# EAGLE design LoRaDevBreakout_FW_RevA (EAGLE 7.2.0)
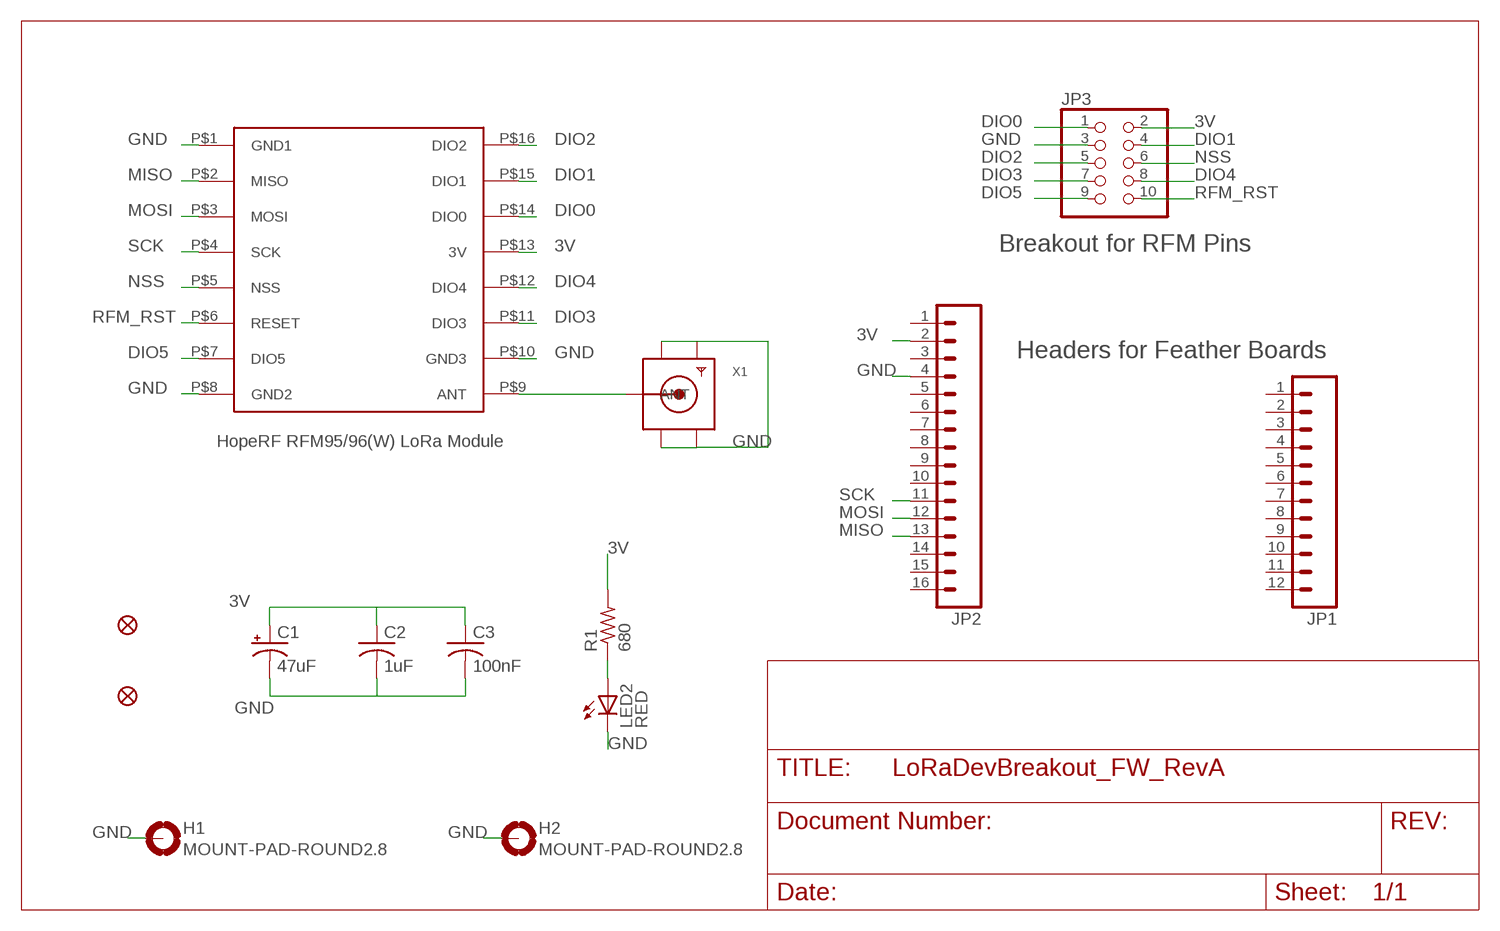
[diagram p0: schematic, sheet 1]

## Parts
C1  47uF  47UF-10V-10%(TANT)  [EIA3528]
C2  1uF  C-USC0603  [C0603]
C3  100nF  C-USC0603  [C0603]
FID1  FIDUCIAL1X2  [FIDUCIAL-1X2]
FID2  FIDUCIAL1X2  [FIDUCIAL-1X2]
H1  MOUNT-PAD-ROUND2.8  [2,8-PAD]
H2  MOUNT-PAD-ROUND2.8  [2,8-PAD]
JP1  M12NO_SILK  [1X12_NO_SILK]
JP2  M161X16_NO_SILK  [1X16_NO_SILK]
JP3  PINHD-2X5  [2X05]
LED2  RED  LEDCHIPLED_0805  [CHIPLED_0805]
R1  680  R-US_R0603  [R0603]
U$2  RFM95W  [RFM95W]
X1  SMACONNECTOR_EDGE  [SMA_EDGELAUNCH]

## Nets
3V: C1.A(+) C2.1 C3.1 JP2.2 JP3.2 R1.2 U$2.P$13(3V)
ANT: U$2.P$9(ANT) X1.P(ANT)
DIO0: JP3.1 U$2.P$14(DIO0)
DIO1: JP3.4 U$2.P$15(DIO1)
DIO2: JP3.5 U$2.P$16(DIO2)
DIO3: JP3.7 U$2.P$11(DIO3)
DIO4: JP3.8 U$2.P$12(DIO4)
DIO5: JP3.9 U$2.P$7(DIO5)
GND: C1.C(-) C2.2 C3.2 H1.B2,8(MOUNT) H2.B2,8(MOUNT) JP2.4 JP3.3 LED2.C U$2.P$1(GND1) U$2.P$8(GND2) U$2.P$10(GND3) X1.GND@1(GND4) X1.GND@2(GND3) X1.GND@3(GND2) X1.GND@4(GND1)
MISO: JP2.13 U$2.P$2(MISO)
MOSI: JP2.12 U$2.P$3(MOSI)
N$9: LED2.A R1.1
NSS: JP3.6 U$2.P$5(NSS)
RFM_RST: JP3.10 U$2.P$6(RESET)
SCK: JP2.11 U$2.P$4(SCK)
Unconnected: JP1.1 JP1.2 JP1.3 JP1.4 JP1.5 JP1.6 JP1.7 JP1.8 JP1.9 JP1.10 JP1.11 JP1.12 JP2.1 JP2.3 JP2.5 JP2.6 JP2.7 JP2.8 JP2.9 JP2.10 JP2.14 JP2.15 JP2.16

## Notes on the sheet
- Breakout for RFM Pins
- Headers for Feather Boards
- HopeRF RFM95/96(W) LoRa Module

## Library data of the parts
C1 = SparkFun-Capacitors:47UF-10V-10%(TANT): CAP-08310 47uF Tantalum SMT 10V 10% (EIA-3528); PROD_ID: CAP-08310
C2 C3 = adafruit:C-US: CAPACITOR, American symbol
FID1 FID2 = SparkFun-Aesthetics:FIDUCIAL: Fiducial Alignment Points Various fiducial points for machine vision alignment.
H1 H2 = holes:MOUNT-PAD-ROUND: MOUNTING PAD, round
JP1 = SparkFun-Connectors:M12: Header 12 Standard 12-pin 0.1" header. Use with straight break away headers (SKU : PRT-00116), right angle break away headers (PRT-00553), swiss pins (PRT-00743), machine pins (PRT-00117), and female headers (PRT-00115).
JP2 = SparkFun-Connectors:M16: 1x16 .1" header
JP3 = pinhead:PINHD-2X5: PIN HEADER
LED2 = adafruit:LED: LED OSRAM: - CHIPLED LG R971, LG N971, LY N971, LG Q971, LY Q971, LO R971, LY R971 LH N974, LH R974 LS Q976, LO Q976, LY Q976 LO Q996 - Hyper CHIPLED LW Q18S LB Q993, LB Q99A, LB R99A - SideLED LS A670, LO A670, LY A670, LG A670, LP A670 LB A673, LV A673, LT A673, LW A673 LH A674 LY A675 LS A676, LA A676, LO A676, LY A676, LW A676 LS A679, LY A679, LG A679 - Hyper Micro SIDELED® LS Y876, LA Y876, LO Y876, LY Y876 LT Y87S - SmartLED LW L88C, LW L88S LB L89C, LB L89S, LG L890 LS L89K, LO L89K, LY L89K LS L896, LA L896, LO L896, LY L896 - TOPLED LS T670, LO T670, LY T670, LG T670, LP T670 LSG T670, LSP T670, LSY T670, LOP T670, LYG T670 LG T671, LOG T671, LSG T671 LB T673, LV T673, LT T673, LW T673 LH T674 LS T676, LA T676, LO T676, LY T676, LB T676, LH T676, LSB T676, LW T676 LB T67C, LV T67C, LT T67C, LS T67K, LO T67K, LY T67K, LW E67C LS E67B, LA E67B, LO E67B, LY E67B, LB E67C, LV E67C, LT E67C LW T67C LS T679, LY T679, LG T679 LS T770, LO T770, LY T770, LG T770, LP T770 LB T773, LV T773, LT T773, LW T773 LH T774 LS E675, LA E675, LY E675, LS T675 LS T776, LA T776, LO T776, LY T776, LB T776 LHGB T686 LT T68C, LB T68C - Hyper Mini TOPLED® LB M676 - Mini TOPLED Santana® LG M470 LS M47K, LO M47K, LY M47K Source: http://www.osram.convergy.de/
R1 = adafruit2:R-US_: RESISTOR, American symbol
U$2 = _CustomParts:RFM95W
X1 = adafruit:SMACONNECTOR: SMA Connector 90° DIP SMA Connector, 50 Ohm (4UConnector: 07259)

## Net classes
1 power: width 0.305 mm

## Board
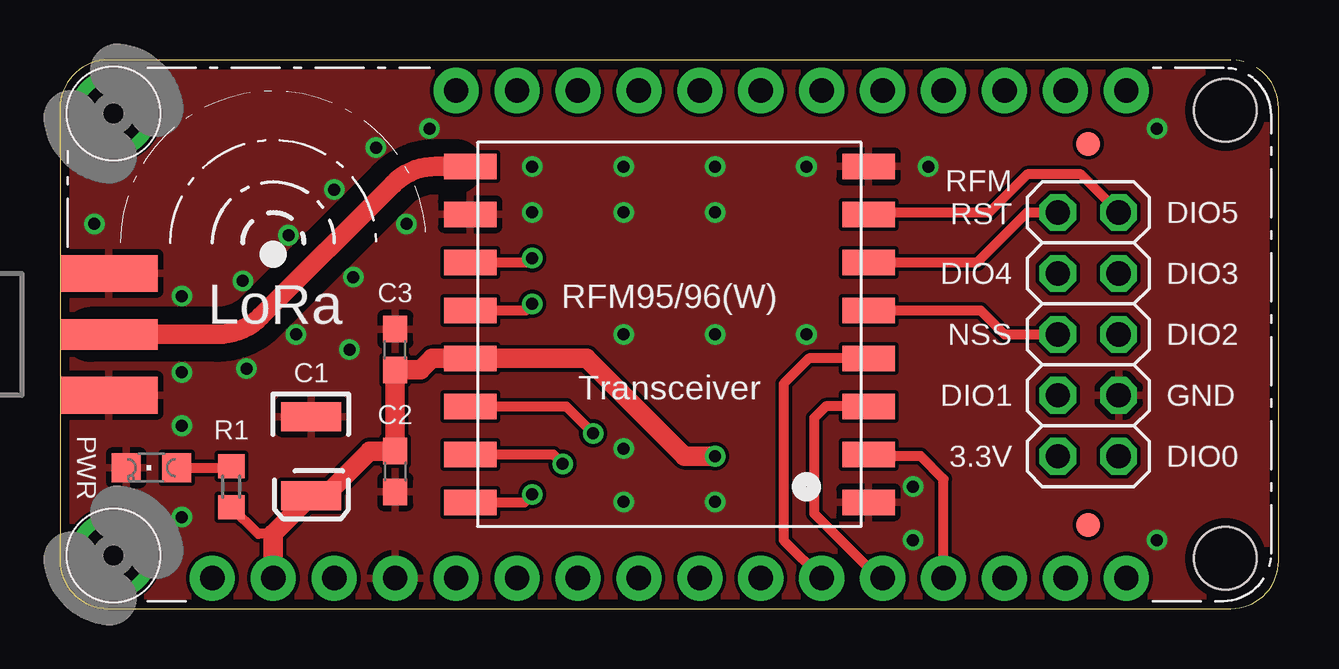
[diagram p1: board, top side]
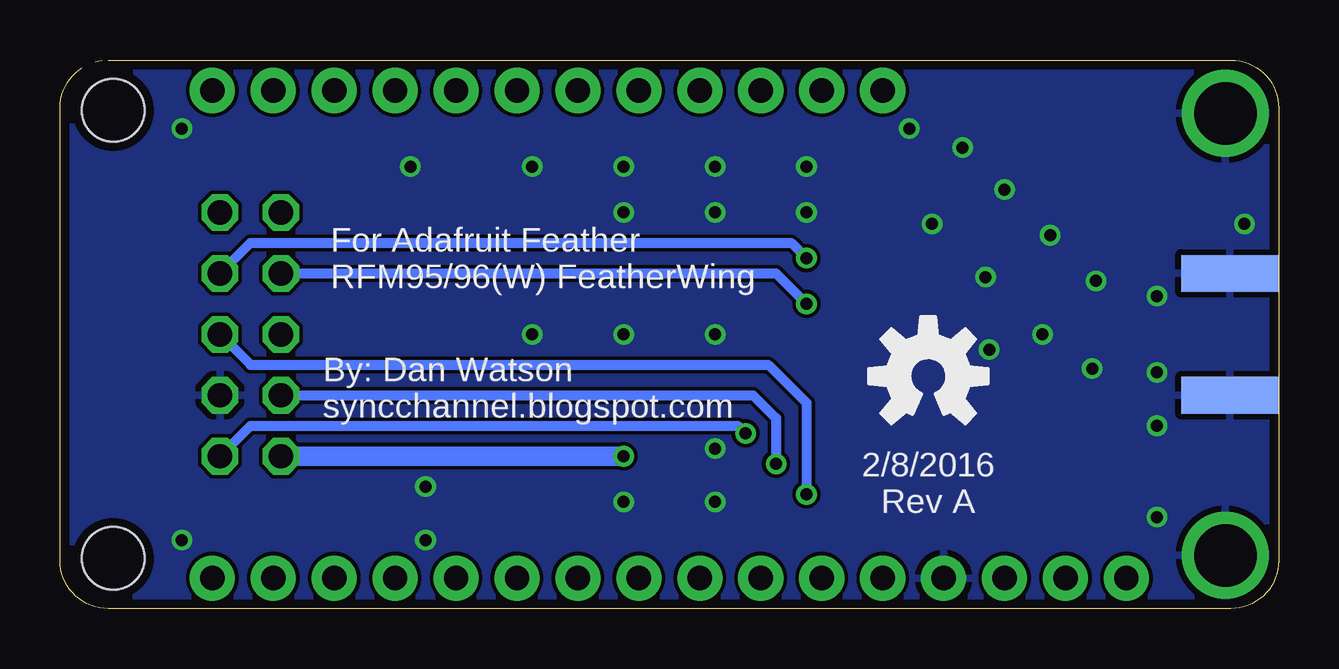
[diagram p2: board, bottom side, seen from below]

Size 50.8 x 22.86 mm. Coordinates in mm from the lower left corner, seen from the top.
Outline: 0,20.86 0,2 arc90 2,0 48.8,0 arc90 50.8,2 50.8,20.86 arc90 48.8,22.86 2,22.86 arc90 0,20.86
Copper layers (1*16): Top 0.0356mm / dielectric 1.5011mm / Bottom 0.0356mm
Design rules "oshpark-2layer *": minimum track width 6mil, minimum drill 13mil, track to track 6mil, track to pad 6mil, pad to pad 6mil, via to via 6mil, smd to smd 6mil, copper to edge 15mil, drill to drill 6mil, minimum pad ring 7mil, minimum via ring 7mil, stop-mask expansion 4mil, vias tented up to drill 20mil, thermal gap 10mil
Holes 2.6 mm at 48.58,20.76 48.58,2.1
tRestrict: 5 lines

### Footprints (pad centres in the part's own frame; a part is rotated, then mirrored left to right if it is on the bottom)
EIA3528 = smd 1.2 x 2.5: A 1.65,0; C -1.65,0
C0603 = smd 1.1 x 1: 1 -0.85,0; 2 0.85,0
FIDUCIAL-1X2 = smd 1 x 1: 1 0,0
2,8-PAD = drill 2.6 pad 3.6: B2,8 0,0
1X12_NO_SILK = drill 1.016 pad 1.88: 1 0,0; 2 2.54,0; 3 5.08,0; 4 7.62,0; 5 10.16,0; 6 12.7,0; 7 15.24,0; 8 17.78,0; 9 20.32,0; 10 22.86,0; 11 25.4,0; 12 27.94,0
1X16_NO_SILK = drill 1.016 pad 1.88: 1 0,0; 2 2.54,0; 3 5.08,0; 4 7.62,0; 5 10.16,0; 6 12.7,0; 7 15.24,0; 8 17.78,0; 9 20.32,0; 10 22.86,0; 11 25.4,0; 12 27.94,0; 13 30.48,0; 14 33.02,0; 15 35.56,0; 16 38.1,0
2X05 = drill 1.016 octagon: 1 -5.08,-1.27; 2 -5.08,1.27; 3 -2.54,-1.27; 4 -2.54,1.27; 5 0,-1.27; 6 0,1.27; 7 2.54,-1.27; 8 2.54,1.27; 9 5.08,-1.27; 10 5.08,1.27
CHIPLED_0805 = smd 1.2 x 1.2: A 0,-1.05; C 0,1.05
R0603 = smd 1 x 1.1: 1 -0.85,0; 2 0.85,0
RFM95W = smd 2.184 x 1.067: P$1 -8.3,7; P$2 -8.3,5; P$3 -8.3,3; P$4 -8.3,1; P$5 -8.3,-1; P$6 -8.3,-3; P$7 -8.3,-5; P$8 -8.3,-7; P$9 8.3,-7; P$10 8.3,-5; P$11 8.3,-3; P$12 8.3,-1; P$13 8.3,1; P$14 8.3,3; P$15 8.3,5; P$16 8.3,7
SMA_EDGELAUNCH = smd 4.064 x 1.524: GND@1 2.032,-2.54; GND@2 2.032,2.54 | smd 4.064 x 1.524 bottom: GND@3 2.032,2.54; GND@4 2.032,-2.54 | smd 4.064 x 1.27: P 2.032,0

### Placement (x,y rotation side)
C1  10.48,6.35 270 top
C2  13.97,10.79 90 top
C3  13.97,5.71 270 top
FID1  42.86,19.37 0 top
FID2  42.86,3.49 0 top
H1  2.22,20.64 0 top
H2  2.22,2.22 0 top
JP1  16.51,21.59 0 top
JP2  6.35,1.27 0 top
JP3  42.86,11.43 90 top
LED2  3.81,5.87 90 top
R1  7.14,5.08 270 top
U$1  [OSHW-LOGO-M]  14.61,9.68 0 bottom
U$2  25.4,11.43 180 top
X1  0,11.43 0 top

### Tracks (layer width: path | path; a pad name or v marks a point on that pad's centre or on a via)
3V  (via drill 0.5)
  Top 0.406: 8.89,3.11 8.26,3.11 R1.2
  Top 0.813: JP2.2 8.89,3.11 C1.A 10.54,4.76 11.11,4.76 12.91,6.57 C3.1 C2.1 15.03,9.95 15.51,10.43 U$2.P$13 21.95,10.43 26.04,6.35 v27.3,6.35
  Bottom 0.813: v27.3,6.35 JP3.2
ANT
  Top 0.813: U$2.P$9 15.67,18.43 arc45 13.88,17.69 8.36,12.17 arc-45 6.57,11.43 X1.P
  Top 1.016: 1.27,11.43 X1.P
DIO0  (via drill 0.5)
  Top 0.406: U$2.P$14 21.1,8.43 v22.23,7.3
  Bottom 0.406: JP3.1 42.86,7.62 22.54,7.62 v22.23,7.3
DIO1  (via drill 0.5)
  Top 0.406: U$2.P$15 20.56,6.43 v20.95,6.03
  Bottom 0.406: JP3.4 21.91,8.89 20.95,7.94 v20.95,6.03
DIO2  (via drill 0.5)
  Top 0.406: U$2.P$16 19.35,4.43 v19.68,4.76
  Bottom 0.406: JP3.5 42.86,10.16 21.27,10.16 19.68,8.57 v19.68,4.76
DIO3  (via drill 0.5)
  Top 0.406: U$2.P$11 19.51,14.43 v19.68,14.61
  Bottom 0.406: JP3.7 42.86,15.24 20.32,15.24 v19.68,14.61
DIO4  (via drill 0.5)
  Top 0.406: U$2.P$12 19.41,12.43 v19.68,12.7
  Bottom 0.406: JP3.8 20.95,13.97 v19.68,12.7
DIO5
  Top 0.406: JP3.9 42.55,18.1 40.32,18.1 38.73,16.51 33.78,16.51 U$2.P$7
GND  (via drill 0.5)
  other vias: 5.08,13.02 5.08,9.84 7.62,13.65 7.78,10 9.53,15.56 11.43,17.46 13.18,19.21 15.4,20 14.45,16.03 12.22,13.81 35.56,5.08 35.56,2.86 31.11,18.41 27.3,18.41 23.5,18.41 19.68,18.41 23.5,16.51 27.3,16.51 27.3,11.43 23.5,11.43 31.11,11.43 23.5,6.67 9.84,11.43 5.08,3.81 5.08,7.62 45.72,2.86 45.72,20 19.68,16.51 36.2,18.41 12.06,10.79 1.43,16.03 23.5,4.45 27.3,4.45
  pour Top: -6.35,26.67 -6.35,-3.81 54.61,-3.81 54.61,26.67
  pour Bottom: -7.62,27.94 -7.62,-5.08 55.88,-5.08 55.88,29.21 -7.62,29.21
MISO
  Top 0.406: JP2.13 36.83,5.4 35.88,6.35 33.78,6.35
  Top 0.61: 33.78,6.35 U$2.P$2
MOSI
  Top 0.406: U$2.P$3 31.93,8.43 31.43,7.94 31.43,3.97 34.13,1.27
  Top 0.61: JP2.12 34.13,1.27
N$9
  Top 0.406: LED2.A 7.09,5.87 R1.1
NSS
  Top 0.406: U$2.P$5 38.37,12.43 39.37,11.43 JP3.6
RFM_RST
  Top 0.406: U$2.P$6 38.24,14.43 40.32,16.51 JP3.10
SCK
  Top 0.406: U$2.P$4 31.23,10.43 30.16,9.37 30.16,2.86 JP2.11

### Text on the board
tNames: RFM / RST | DIO5 | DIO4 | DIO3 | LoRa | C3 | RFM95/96(W) | NSS | DIO2 | C1 | Transceiver | DIO1 | GND | C2 | R1 | PWR | 3.3V | DIO0
bNames: For Adafruit Feather / RFM95/96(W) FeatherWing | By: Dan Watson / syncchannel.blogspot.com | 2/8/2016 / Rev A